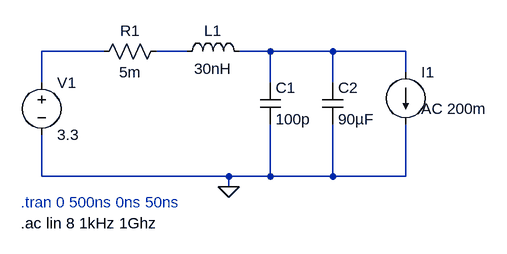
[diagram p0: schematic Draft1.asc]
Draft1.asc, the LTspice schematic file:
Version 4.1
SHEET 1 880 680
WIRE 80 80 -16 80
WIRE 208 80 160 80
WIRE 336 80 288 80
WIRE 432 80 336 80
WIRE 544 80 432 80
WIRE 544 112 544 80
WIRE -16 128 -16 80
WIRE 336 128 336 80
WIRE 432 128 432 80
WIRE -16 272 -16 208
WIRE 272 272 -16 272
WIRE 336 272 336 192
WIRE 336 272 272 272
WIRE 432 272 432 192
WIRE 432 272 336 272
WIRE 544 272 544 192
WIRE 544 272 432 272
WIRE 272 288 272 272
FLAG 272 288 0
SYMBOL voltage -16 112 R0
SYMATTR InstName V1
SYMATTR Value 3.3
SYMBOL res 176 64 R90
WINDOW 0 0 56 VBottom 2
WINDOW 3 32 56 VTop 2
SYMATTR InstName R1
SYMATTR Value 5m
SYMBOL ind 192 96 R270
WINDOW 0 32 56 VTop 2
WINDOW 3 5 56 VBottom 2
SYMATTR InstName L1
SYMATTR Value 30nH
SYMBOL cap 320 128 R0
SYMATTR InstName C1
SYMATTR Value 100p
SYMBOL cap 416 128 R0
SYMATTR InstName C2
SYMATTR Value 90µF
SYMBOL current 544 112 R0
WINDOW 3 24 28 Invisible 2
WINDOW 123 24 56 Left 2
WINDOW 39 0 0 Left 0
SYMATTR InstName I1
SYMATTR Value ""
SYMATTR Value2 AC 200m
TEXT -48 312 Left 2 ;.tran 0 500ns 0ns 50ns
TEXT -48 344 Left 2 !.ac lin 8 1kHz 1Ghz

The netlist it stands for:
* Draft1.asc
V1 N001 0 3.3
R1 N002 N001 5m
L1 N002 N003 30nH
C1 N003 0 100p
C2 N003 0 90µF
I1 N003 0 AC 200m
* .tran 0 500ns 0ns 50ns
.ac lin 8 1kHz 1Ghz
.backanno
.end